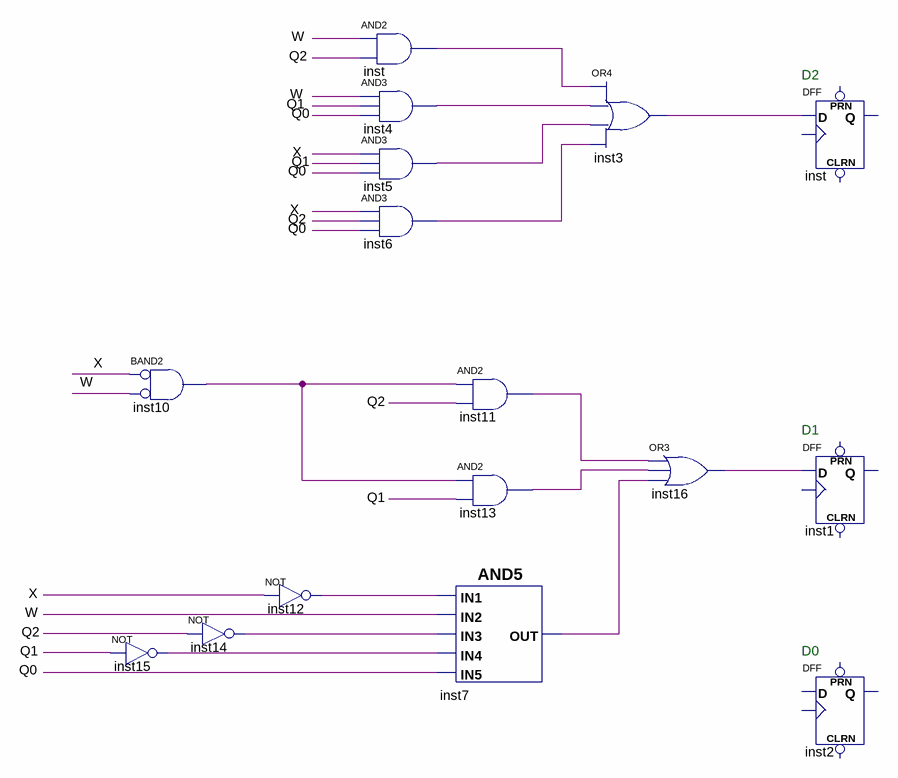
[diagram p0: schematic sheet]
// Quartus schematic FF_deibid.bdf as structural Verilog: 16 symbols, 0 pins
module FF_deibid (
);

  wire inst3_out, inst4_out, inst5_out, inst6_out, inst7_out, inst10_out, inst11_out, inst12_out, inst13_out,
       inst14_out, inst15_out, inst16_out, inst_out, Q0, Q1, Q2, W, X;

  and inst10 (inst10_out, ~X, ~W);  // BAND2
  not inst15 (inst15_out, Q1);
  not inst14 (inst14_out, Q2);
  not inst12 (inst12_out, X);
  and inst (inst_out, W, Q2);
  and inst4 (inst4_out, W, Q1, Q0);
  and inst5 (inst5_out, X, Q1, Q0);
  and inst6 (inst6_out, X, Q2, Q0);
  and inst11 (inst11_out, inst10_out, Q2);
  and inst13 (inst13_out, inst10_out, Q1);
  and inst7 (inst7_out, inst12_out, W, inst14_out, inst15_out, Q0);
  or inst3 (inst3_out, inst_out, inst4_out, inst5_out, inst6_out);
  or inst16 (inst16_out, inst11_out, inst13_out, inst7_out);
  DFF inst_dup2 (.D(inst3_out));  // open: CLRN, CLK, PRN, Q
  DFF inst1 (.D(inst16_out));  // open: CLRN, CLK, PRN, Q
  DFF inst2 ();  // open: CLRN, CLK, D, PRN, Q

  // Notes on the sheet:
  //   D2
  //   D1
  //   D0
endmodule
